# Altium project VOLTAGE_PEAK_V2.PrjPCB
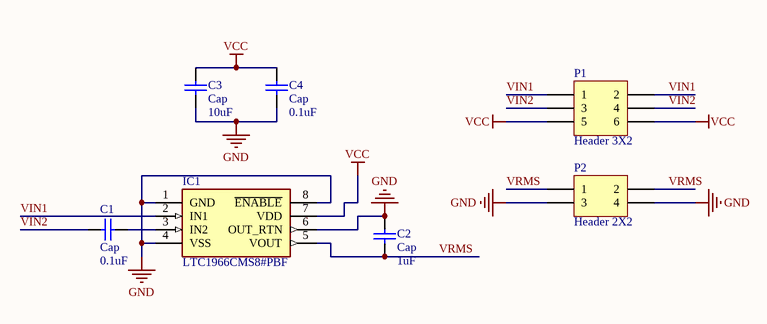
[diagram p0: VOLTAGE_PEAK_V2.SchDoc]
1 sheet, 7 parts. Net scope: global (net labels, ports and power ports of the same name join across sheets).
Board file: VOLTAGE_PEAK_V2.PcbDoc

## Sheet VOLTAGE_PEAK_V2.SchDoc
size A4

### Parts
C1  Cap  value 0.1uF  [1608[0603]]
C2  Cap  value 1uF  [1608[0603]]
C3  Cap  value 10uF  [1608[0603]]
C4  Cap  value 0.1uF  [1608[0603]]
IC1  LTC1966CMS8#PBF  [SOP65P490X110-8N]
P1  Header 3X2  [HDR2X3]
P2  Header 2X2  [HDR2X2]

### Nets
GND: C2.2 C3.1 C4.1 IC1.1(GND) IC1.4(VSS) IC1.6(OUT_RTN) IC1.8(~{ENABLE}) P2.3 P2.4
VCC: C3.2 C4.2 IC1.7(VDD) P1.5 P1.6
VIN1: IC1.2(IN1) P1.1 P1.2
VIN2: C1.1 P1.3 P1.4
VRMS: C2.1 IC1.5(VOUT) P2.1 P2.2
NetC1_2: C1.2 IC1.3(IN2)

### Library data of the parts
C1-C4 = Cap: Capacitor; Published: 8-Jun-2000; LatestRevisionDate: 17-Jul-2002; LatestRevisionNote: Re-released for DXP Platform.; PackageReference: RAD-0.3; Publisher: Altium Limited; PackageDescription: Radial Cap, Thru-Hole; 2 Leads; 0.3 in Pin Spacing
IC1 = LTC1966CMS8#PBF: Integrated Circuit; Manufacturer_Name: Linear Technology; Datasheet Link: http://docs-emea.rs-online.com/webdocs/10ed/0900766b810ed9a6.pdf; Height: 1.1mm; Manufacturer_Part_Number: LTC1966CMS8#PBF; RS Part Number: 7619266P; RS Price/Stock: http://uk.rs-online.com/web/p/products/7619266P
P1 = Header 3X2: Header, 3-Pin, Dual row; LatestRevisionDate: 17-Jul-2002; LatestRevisionNote: Re-released for DXP Platform.; Publisher: Altium Limited
P2 = Header 2X2: Header, 2-Pin, Dual row; LatestRevisionDate: 17-Jul-2002; LatestRevisionNote: Re-released for DXP Platform.; Publisher: Altium Limited